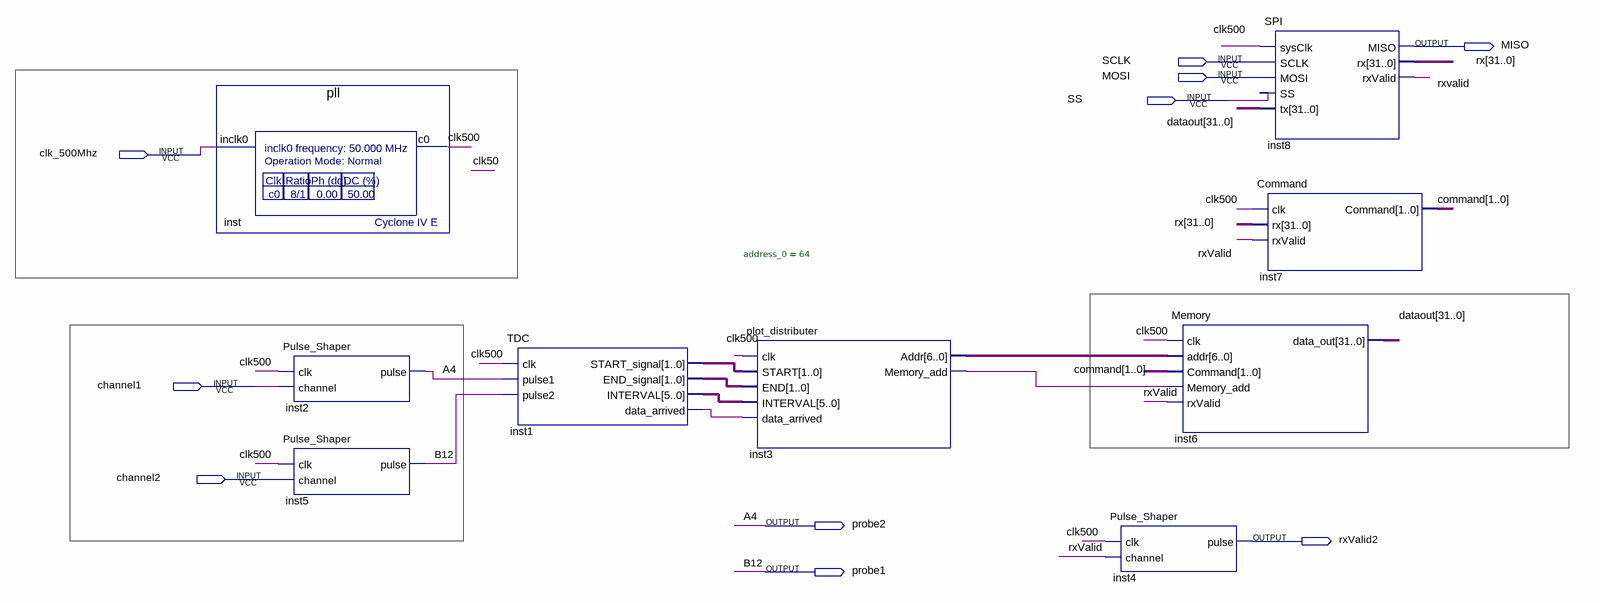
[diagram p0: schematic sheet]
// Quartus schematic TCA.bdf as structural Verilog: 9 symbols, 10 pins
module TCA (
  input  SCLK,
  input  MOSI,
  input  SS,
  input  clk_500Mhz,
  input  channel1,
  input  channel2,
  output MISO,
  output probe2,
  output rxValid2,
  output probe1
);

  wire clk500, inst1_data_arrived, inst3_memory_add, rxValid;
  wire [1:0] command, inst1_end_signal, inst1_start_signal;
  wire [5:0] inst1_interval;
  wire [6:0] inst3_addr;
  wire [31:0] dataout, rx;

  pll inst (.inclk0(clk_500Mhz), .c0(clk500));
  Pulse_Shaper inst2 (.clk(clk500), .channel(channel1), .pulse(probe2));
  Pulse_Shaper inst5 (.clk(clk500), .channel(channel2), .pulse(probe1));
  TDC inst1 (
    .clk(clk500), .pulse1(probe2), .pulse2(probe1), .START_signal(inst1_start_signal),
    .END_signal(inst1_end_signal), .INTERVAL(inst1_interval), .data_arrived(inst1_data_arrived));
  plot_distributer #(.address_0(64)) inst3 (
    .clk(clk500), .START(inst1_start_signal), .END(inst1_end_signal), .INTERVAL(inst1_interval),
    .data_arrived(inst1_data_arrived), .Addr(inst3_addr), .Memory_add(inst3_memory_add));
  Pulse_Shaper inst4 (.clk(clk500), .channel(rxValid), .pulse(rxValid2));
  Memory inst6 (
    .clk(clk500), .addr(inst3_addr), .Command(command), .Memory_add(inst3_memory_add), .rxValid(rxValid),
    .data_out(dataout));
  SPI inst8 (.sysClk(clk500), .SCLK(SCLK), .MOSI(MOSI), .SS(SS), .tx(dataout), .MISO(MISO), .rx(rx), .rxValid(rxValid));
  Command inst7 (.clk(clk500), .rx(rx), .rxValid(rxValid), .Command(command));

  // Other names for the same wires on the sheet: A4 = probe2; B12 = probe1
endmodule
